# EasyEDA Pro project ProPrj_MEMSdesign_2025-04-10.epro, schematic F103_1

## Sheets
1 core: Board Name: main_1; Create Date: 2025-03-18; Page Name: core; Project Name: MEMSdesign; Schematic Name: F103_1; Update Date: 2025-04-07; Company: 嘉立创EDA; Page Size: A4; Reviewed: 嘉立创EDA
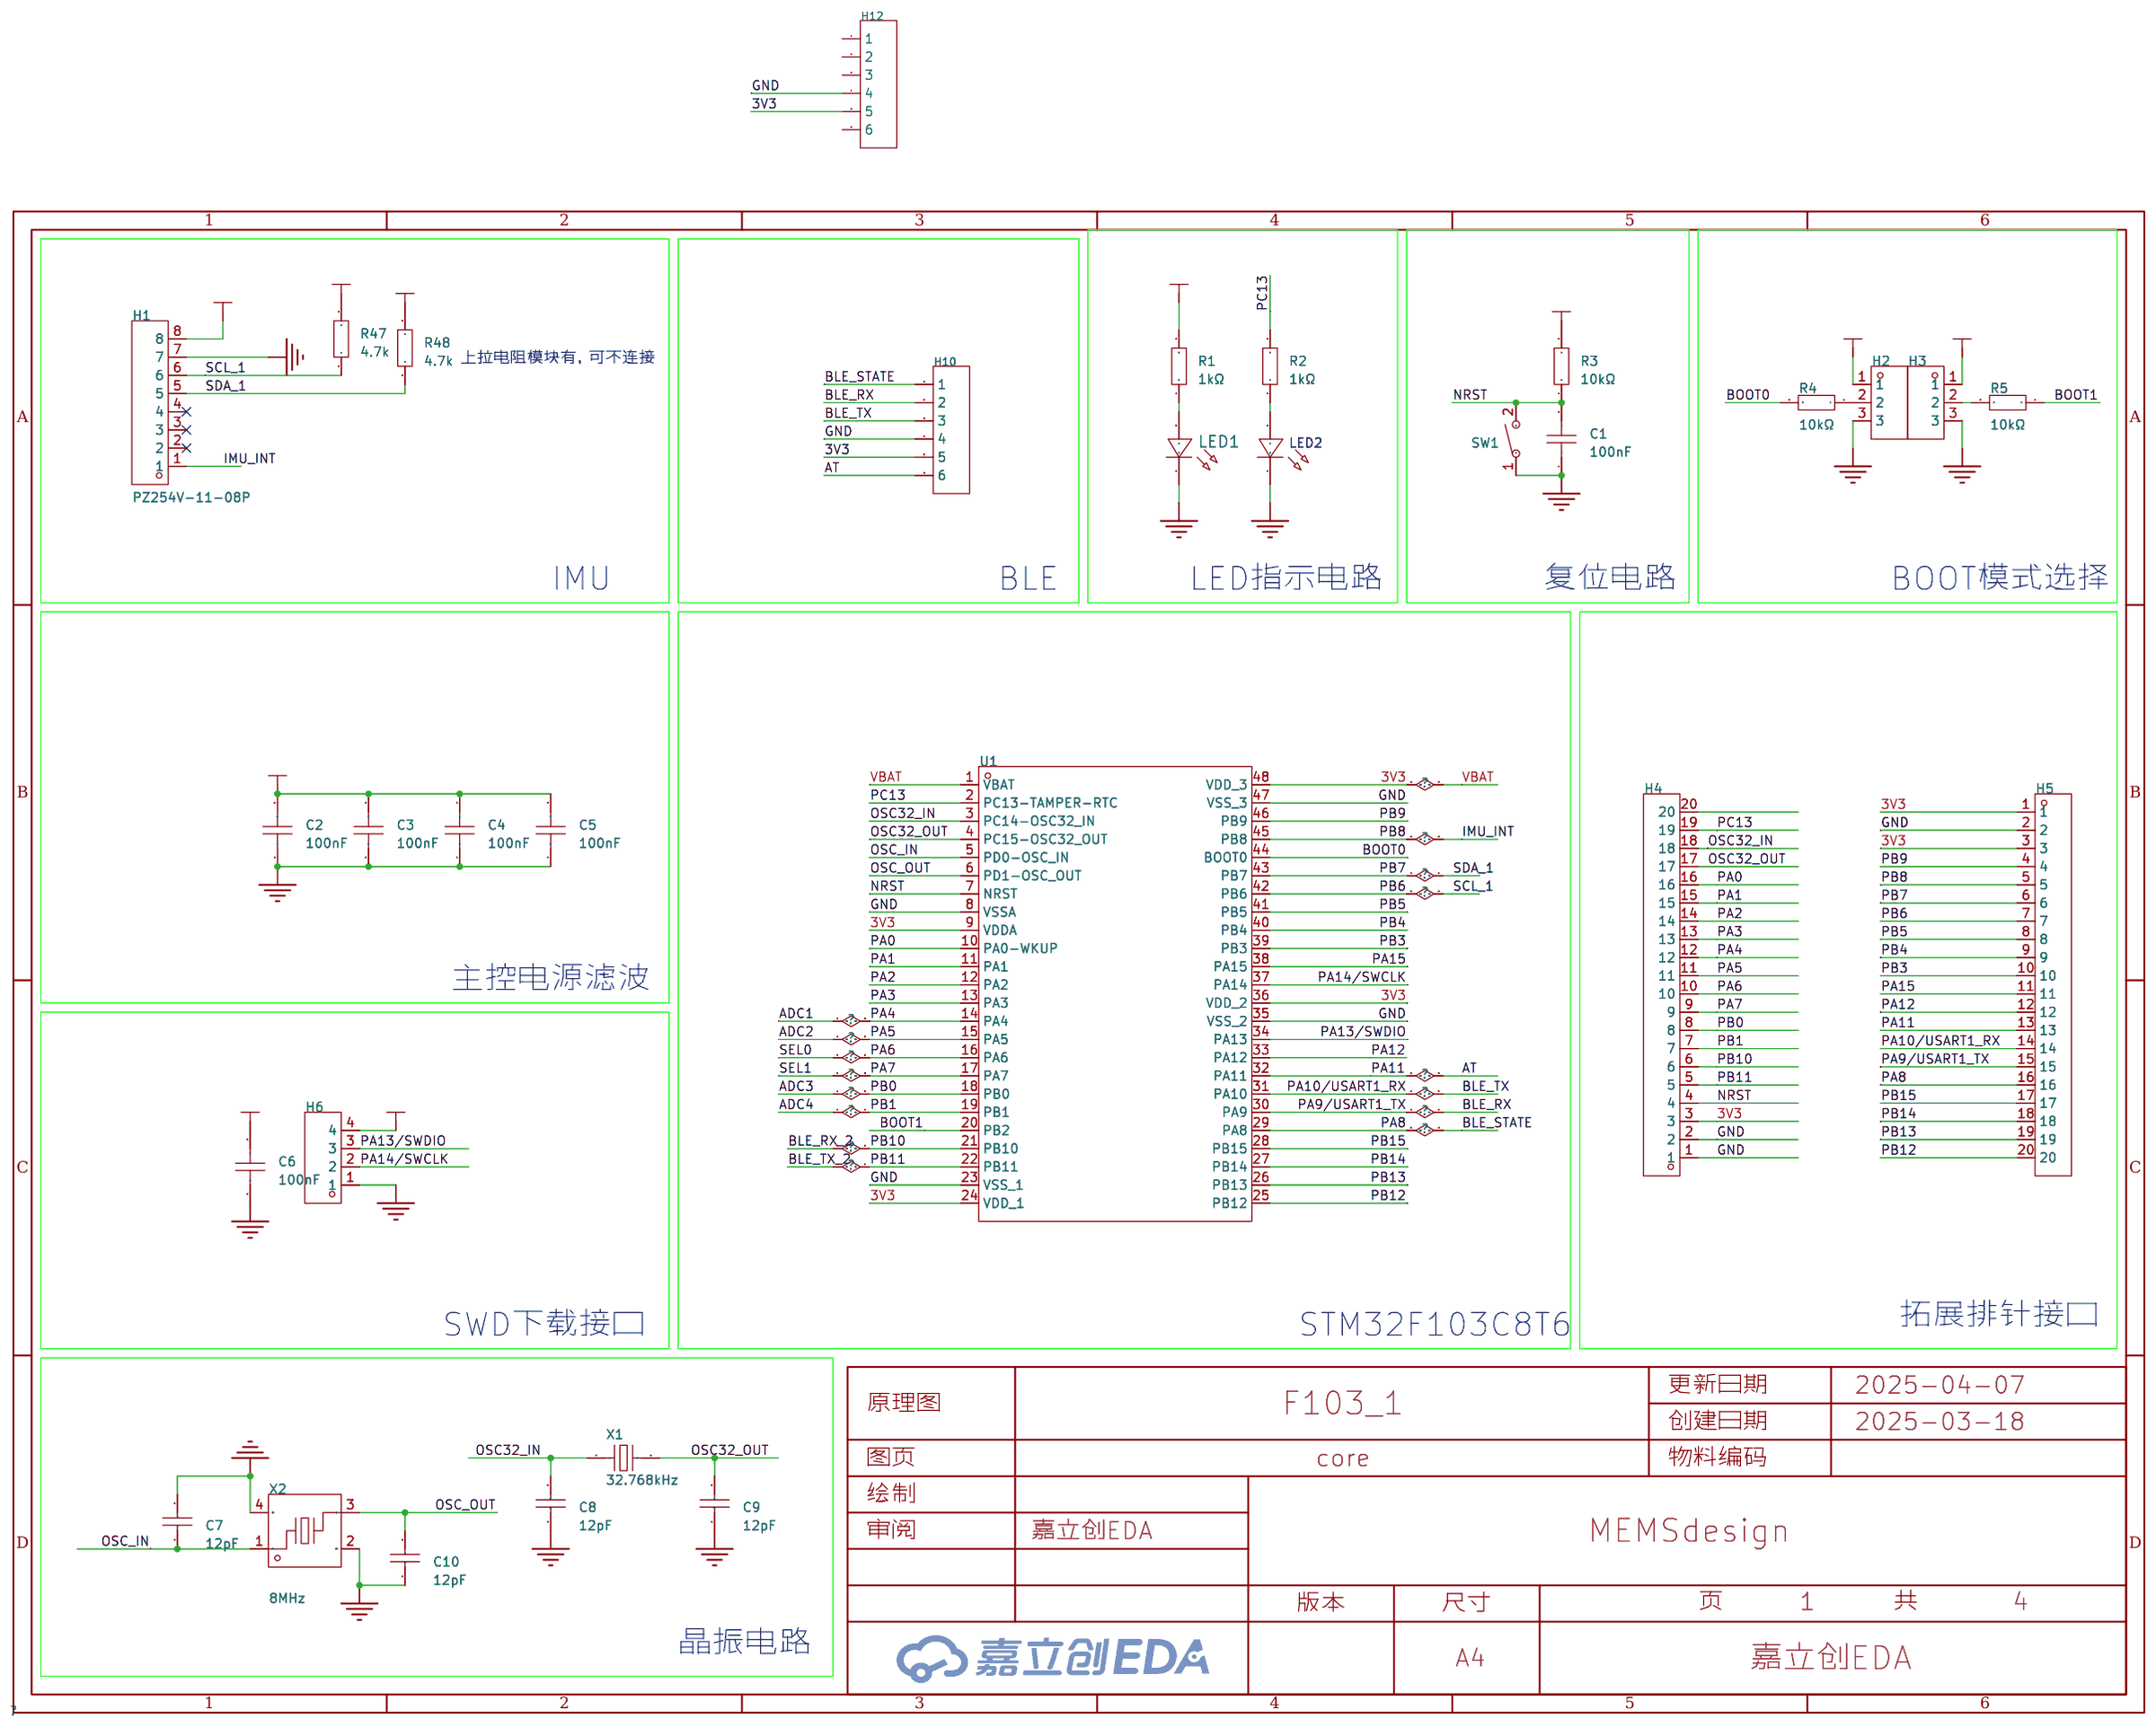
[diagram p0: core]
2 power: Page Name: power; Update Date: 2025-03-18; Version: V1.0
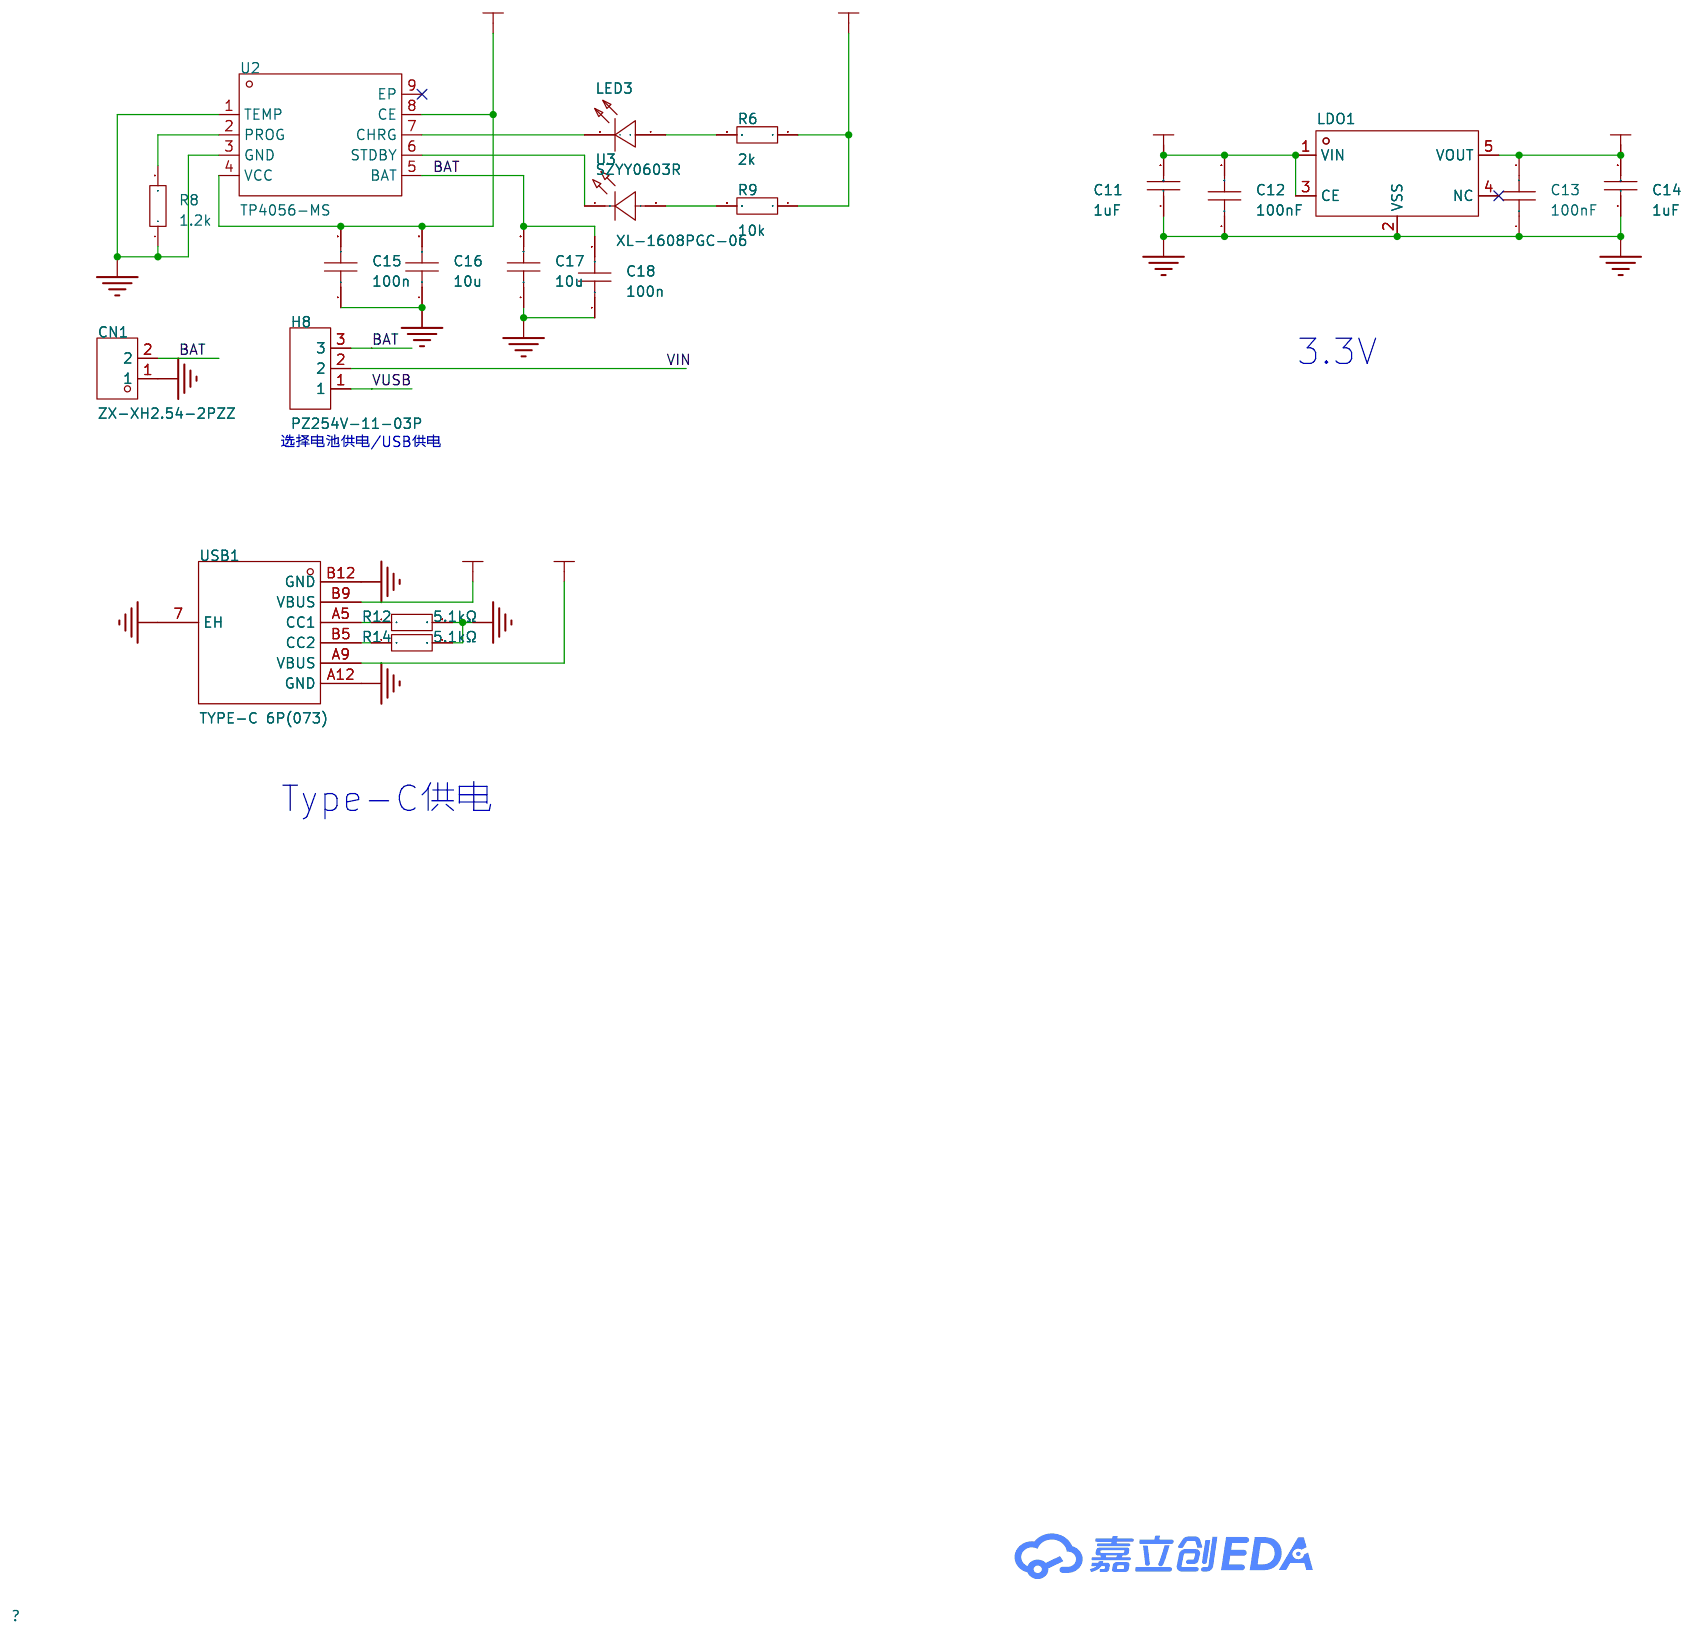
[diagram p1: power]
3 sample: Page Name: sample; Version: V1.0
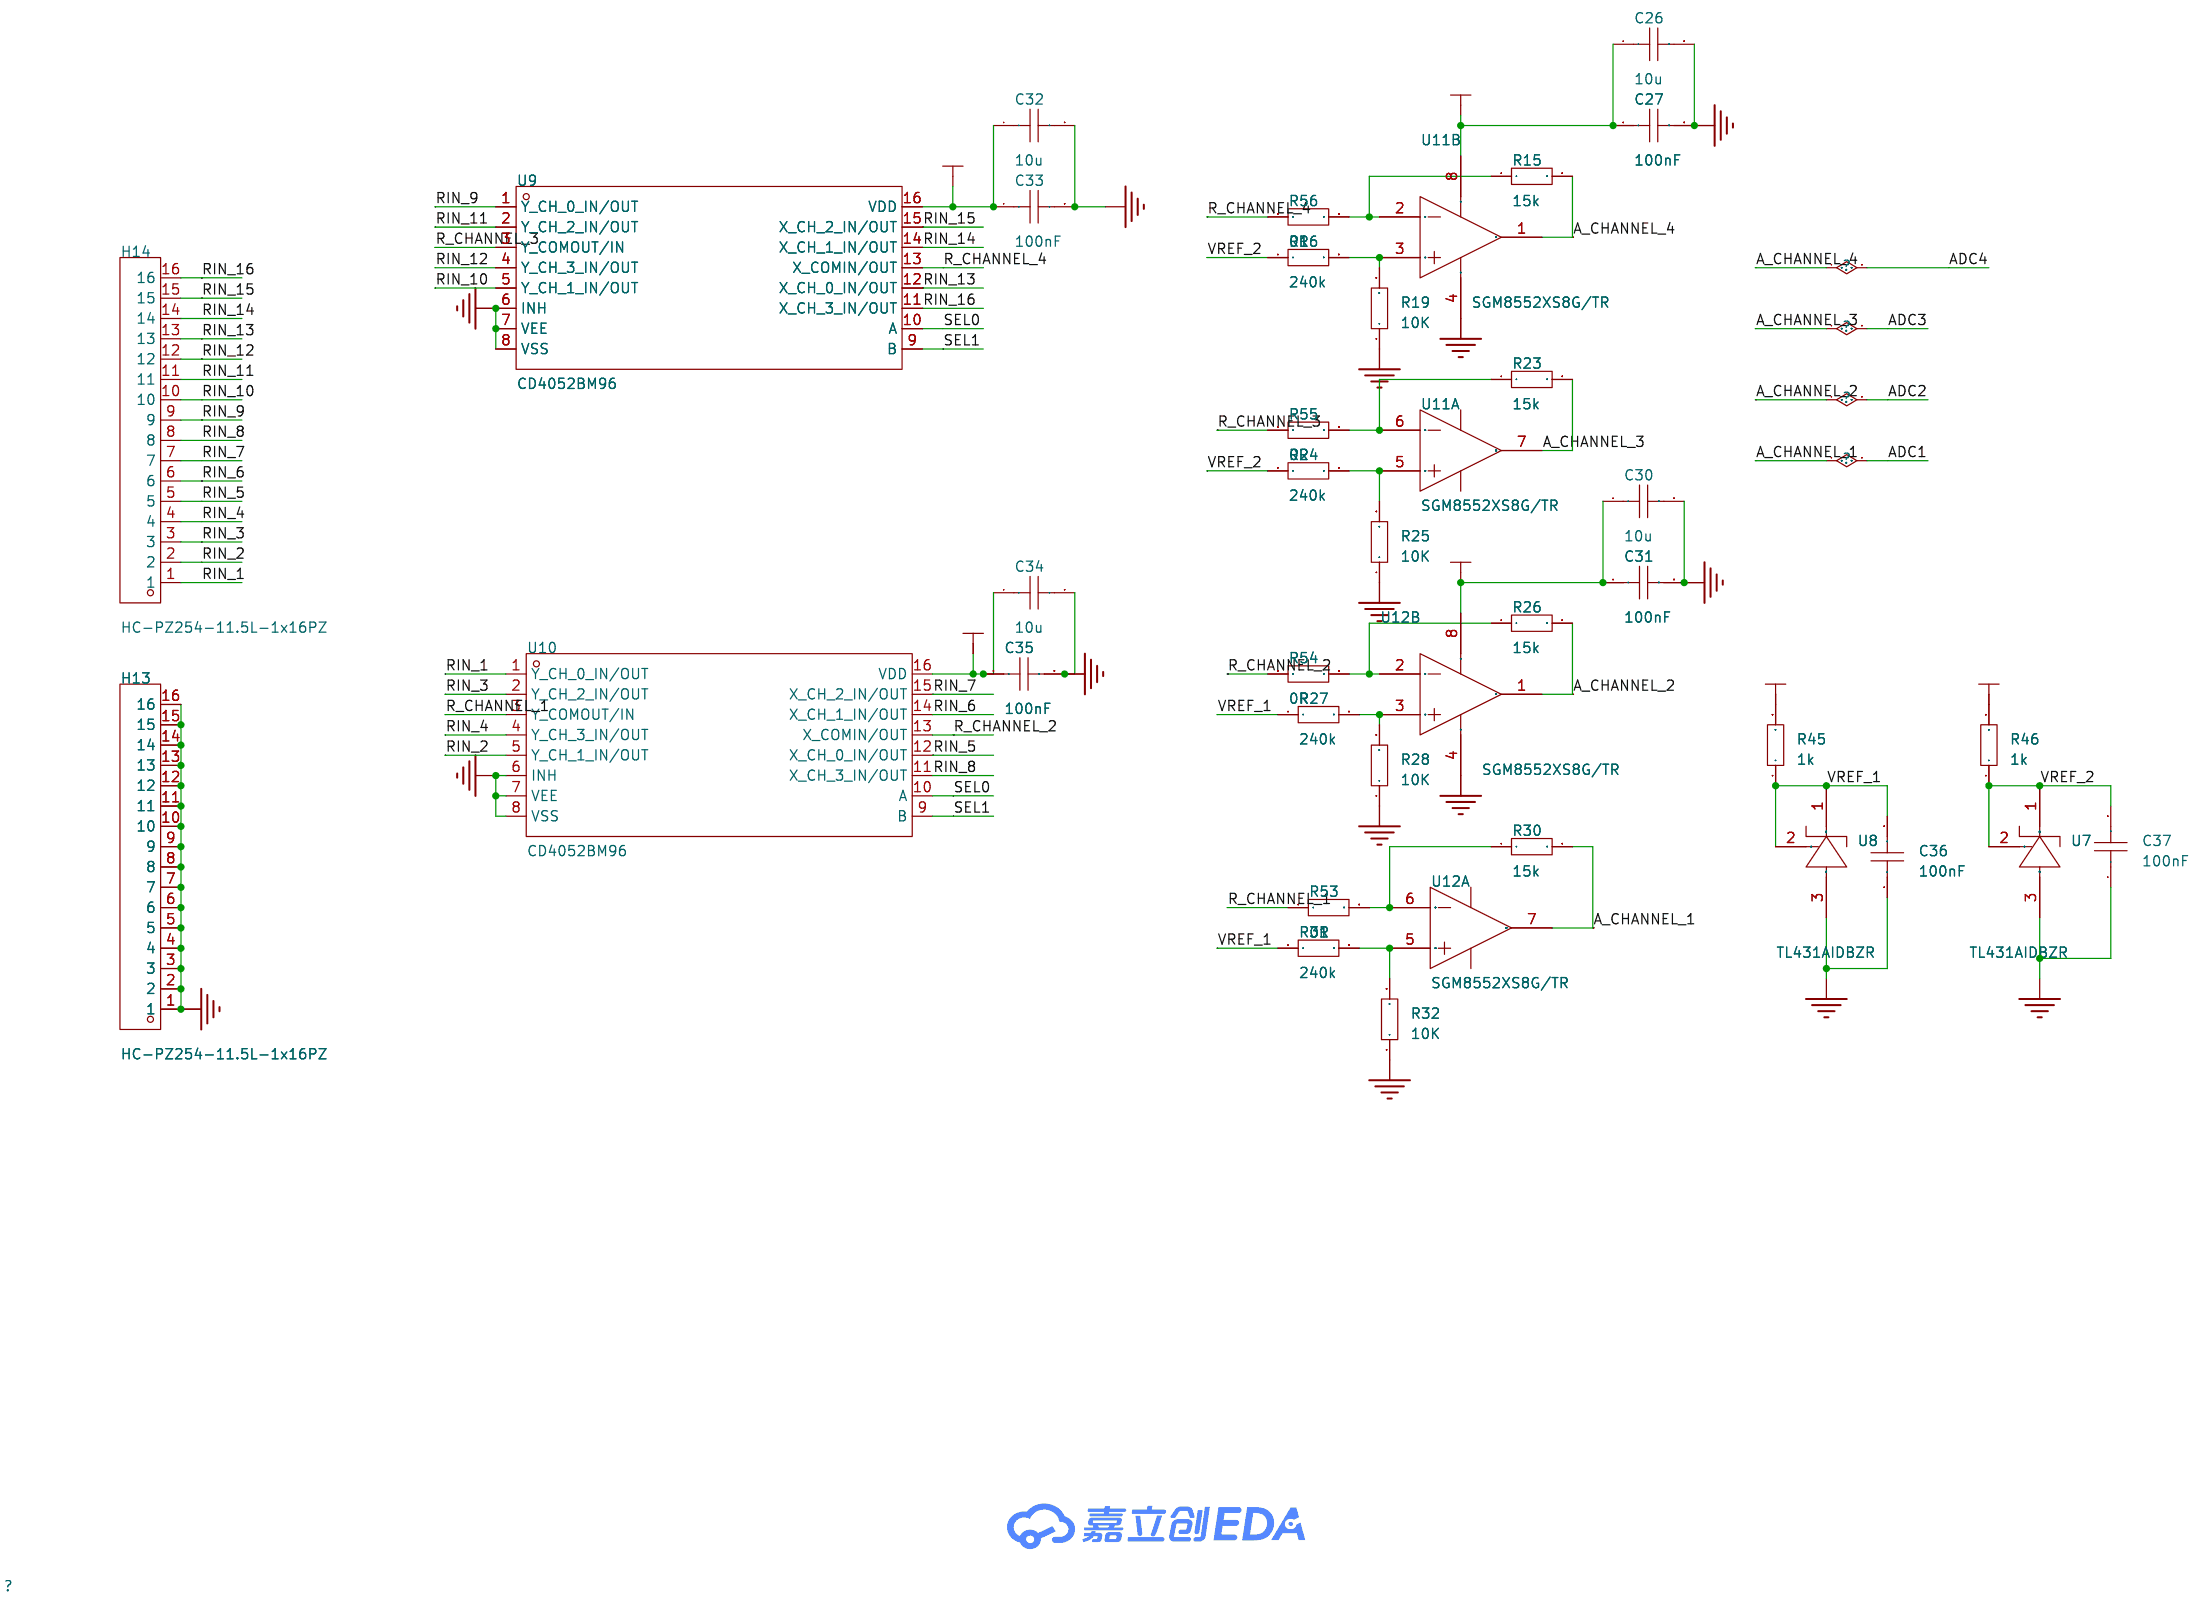
[diagram p2: sample]
4 ble: Page Name: ble; Update Date: 2025-03-18; Version: V1.0
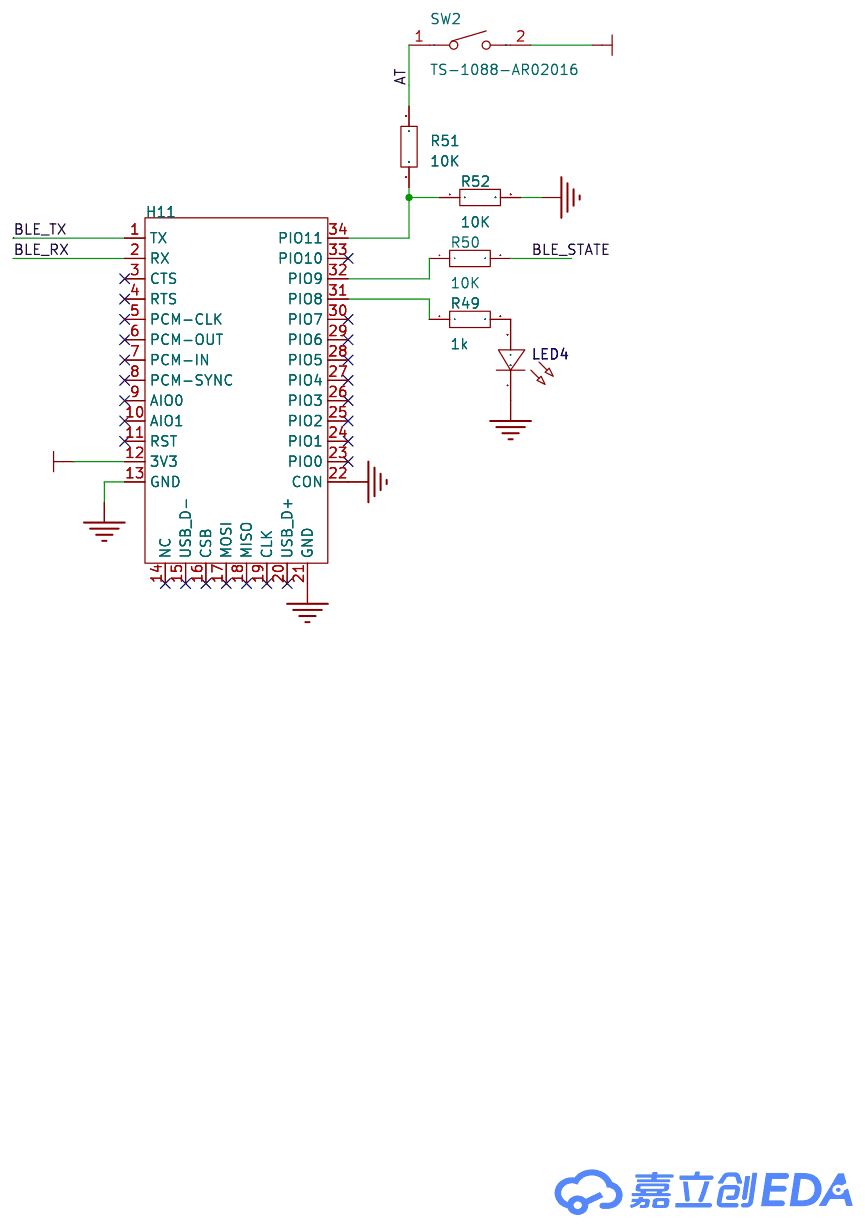
[diagram p3: ble]

## Parts
sheet ble
H11  HC05  [BULETM-SMD_HC-05]
LED4  -  [LED_0603]
R49  1k  [R0603]
R50  10K  [R0603]
R51  10K  [R0603]
R52  10K  [R0603]
SW2  TS-1088-AR02016  [SW-SMD_L3.9-W3.0-P4.45]
sheet core
C1  100nF  [C0603]
C2  100nF  [C0603]
C3  100nF  [C0603]
C4  100nF  [C0603]
C5  100nF  [C0603]
C6  100nF  [C0603]
C7  12pF  [C0402]
C8  12pF  [C0402]
C9  12pF  [C0402]
C10  12pF  [C0402]
H1  PZ254V-11-08P  [HDR-TH_8P-P2.54-V-M]
H2  -  [HDR-TH_3P-P2.54-V-M]
H3  -  [HDR-TH_3P-P2.54-V-M]
H4  -  [HDR-TH_20P-P2.54-V-M-1]
H5  -  [HDR-TH_20P-P2.54-V-M-1]
H6  -  [HDR-TH_4P-P2.54-V-M]
H10  -  [HDR-TH_6P-P2.54-V-M-1]
H12  -  [HDR-TH_6P-P2.54-V-M-1]
LED1  -  [LED_0603]
LED2  -  [LED_0603]
R1  1kΩ  [R0603]
R2  1kΩ  [R0603]
R3  10kΩ  [R0603]
R4  10kΩ  [R0603]
R5  10kΩ  [R0603]
R47  4.7k  [R0603]
R48  4.7k  [R0603]
SW1  TS-1101-B-W  [KEY-SMD_2P-L6.0-W3.6-P7.4-LS8.0-L]
U1  STM32F103C8T6  [LQFP-48_L7.0-W7.0-P0.50-LS9.0-BL]
X1  32.768kHz  [OSC-SMD_L3.2-W1.5]
X2  8MHz  [CRYSTAL-SMD_4P-L3.2-W2.5-BL-1]
sheet power
C11  1uF  [C0603]
C12  100nF  [C0603]
C13  100nF  [C0603]
C14  1uF  [C0603]
C15  100n  [C0603]
C16  10u  [C0603]
C17  10u  [C0603]
C18  100n  [C0603]
CN1  ZX-XH2.54-2PZZ  [CONN-TH_2P-P2.50_HX25003-2A]
H8  PZ254V-11-03P  [HDR-TH_3P-P2.54-V-M]
LDO1  ME6211C33M5G-N  [SOT-23-5_L3.0-W1.7-P0.95-LS2.8-BL]
LED3  SZYY0603R  [LED0603-R-RD]
R6  2k  [R0603]
R8  1.2k  [R0603]
R9  10k  [R0603]
R12  5.1kΩ  [R0603]
R14  5.1kΩ  [R0603]
U2  TP4056-MS  [SOP-8_L4.9-W3.9-P1.27-LS6.0-TL-EP]
U3  XL-1608PGC-06  [LED0603-RD_GREEN]
USB1  TYPE-C 6P(073)  [TYPE-C-SMD_TYPE-C-6P_5]
sheet sample
C26  10u  [C0603]
C27  100nF  [C0603]
C30  10u  [C0603]
C31  100nF  [C0603]
C32  10u  [C0603]
C33  100nF  [C0603]
C34  10u  [C0603]
C35  100nF  [C0603]
C36  100nF  [C0603]
C37  100nF  [C0603]
H13  HC-PZ254-11.5L-1x16PZ  [HDR-TH_16P-P2.54-V-M]
H14  HC-PZ254-11.5L-1x16PZ  [HDR-TH_16P-P2.54-V-M]
R15  15k  [R0603]
R16  240k  [R0603]
R19  10K  [R0603]
R23  15k  [R0603]
R24  240k  [R0603]
R25  10K  [R0603]
R26  15k  [R0603]
R27  240k  [R0603]
R28  10K  [R0603]
R30  15k  [R0603]
R31  240k  [R0603]
R32  10K  [R0603]
R45  1k  [R0603]
R46  1k  [R0603]
R53  0R  [R0603]
R54  0R  [R0603]
R55  0R  [R0603]
R56  0R  [R0603]
U7  TL431AIDBZR  [SOT-23-3_L2.9-W1.6-P1.90-LS2.8-BR]
U8  TL431AIDBZR  [SOT-23-3_L2.9-W1.6-P1.90-LS2.8-BR]
U9  CD4052BM96  [SOIC-16_L9.9-W3.9-P1.27-LS6.0-BL]
U10  CD4052BM96  [SOIC-16_L9.9-W3.9-P1.27-LS6.0-BL]
U11  SGM8552XS8G/TR  [SOIC-8_L4.9-W3.9-P1.27-LS6.0-BL]  (sections 1,2)
U12  SGM8552XS8G/TR  [SOIC-8_L4.9-W3.9-P1.27-LS6.0-BL]  (sections 1,2)

## Library data of the parts
H11 = HC05: _: 3
LED2 LED4 = LED_0603-B: Supplier Footprint: 0603; Supplier Part: C84266
R6 R8 R9 R15 R16 R19 R23-R28 R30-R32 R45-R56 = Res_0603: Supplier Footprint: 0603
SW2 = TS-1088-AR02016: 电路结构:单刀单掷;按钮形状:圆形按钮;作用力:160gf;安装方式:立贴;开关长度:4mm;开关宽度:3mm;开关高度:2mm;带支架:不带;触点电流:50mA;额定电压(DC):12V;绝缘电阻:100MΩ;机械寿命:10万次;; LCSC Part Name: 4*3*2mm 立贴 轻触开关; Supplier Part: C720477; Manufacturer: XUNPU(讯普); Supplier Footprint: SMD; JLCPCB Part Class: 扩展库; Datasheet: https://atta.szlcsc.com/upload/public/pdf/source/20200810/C720475_60D09DD6C54279ADDB2DC25100F1CC11.pdf; Supplier: LCSC; Circuit: 单刀单掷; Actuator Style: 圆形按钮; Operating Force: 160gf; Mounting Style: 立贴; Switch Length: 4mm; Switch Width: 3mm; Switch Height: 2mm; Strike Gundam: 不带; Contact Current: 50mA; Voltage Rating (DC): 12V; Insulation Resistance: 100MΩ; Actuator/Cap Color: 黑色; Pin Style: SMD接片; Mechanical Life: 10万次; Operating Temperature: -30℃~+80℃
C1-C6 C12 C13 = GRM155R71H104KE14D: 容值:100nF;精度:±10%;额定电压:50V;材质(温度系数):X7R;; LCSC Part Name: 100nF ±10% 50V; Supplier Part: C77020; Manufacturer: muRata(村田); Supplier Footprint: 0402; JLCPCB Part Class: 扩展库; Datasheet: https://atta.szlcsc.com/upload/public/pdf/source/20180326/C77020_39BD49C951FF1AF0DB1F1FAC5AC1E401.pdf; Supplier: LCSC; Tolerance: ±10%; Voltage Rated: 50V; Temperature Coefficient: X7R
C7-C10 = 0402CG120J500NT: 容值:12pF;精度:±5%;额定电压:50V;材质(温度系数):C0G;; LCSC Part Name: 12pF ±5% 50V; Supplier Part: C1547; Manufacturer: FH(风华); Supplier Footprint: 0402; JLCPCB Part Class: 基础库; Datasheet: https://atta.szlcsc.com/upload/public/pdf/source/20200305/C486355_26A10D38EF8C2A5C37091D0039909270.pdf; Supplier: LCSC; Tolerance: ±5%; Voltage Rated: 50V; Temperature Coefficient: C0G
H1 = PZ254V-11-08P: 插针结构:1x8P;间距:2.54mm;行距:-;圆针/方针:方针;安装类型:直插;排数:单排;总PIN位数:8P;额定电流:-;额定电压:-;配合针长度:6mm;塑高:2.5mm;端接针长度:3mm;触头材质:黄铜;触头镀层:-;工作温度范围:-40℃~+105℃;颜色:黑色;; LCSC Part Name: 间距:2.54mm 1x8P 直插 方针; Supplier Part: C492407; Manufacturer: XFCN(兴飞); Supplier Footprint: 插件,P=2.54mm; JLCPCB Part Class: 扩展库; Datasheet: https://atta.szlcsc.com/upload/public/pdf/source/20200309/C492407_83A6FB26A2233368EDB9516968EC6149.pdf; Supplier: LCSC; Pin Structure: 1x8P; Pitch: 2.54mm; Circluar Pins/Square Pins: 方针; Mounting Type: 直插; Number of Rows: 单排; Number of Pins: 8P; Length of Mating Pin: 6mm; Insulation Height: 2.5mm; Length of End Connection Pin: 3mm; Contact Material: 黄铜; Operating Temperature Range: -40℃~+105℃; Color: 黑色
H2 H3 = HDR-M_2.54_1x3P: Supplier Part: C2937625; Supplier Footprint: 插件
H4 H5 = HDR-M_2.54_1x20P: 间距:2.54mm;总PIN位数:20;排数:1;插针结构:-;行距:-;安装类型:直插;圆针/方针:-;额定电流:-;额定电压:-;配合针长度:-;塑高:-;触头材质:黄铜;触头镀层:-;颜色:黑色;; Supplier Part: C50981; Supplier Footprint: 插件
H6 = HDR-M_2.54_1x4P: Supplier Part: C2935929; Supplier Footprint: 插件
H10 H12 = HDR-M_2.54_1x6P: Supplier Part: C37208; Supplier Footprint: 插件
LED1 = LED_0603-R: Supplier Footprint: 0603; Supplier Part: C84263
R1 R2 = 0402WGF1001TCE: 电阻类型:厚膜电阻;阻值:1kΩ;精度:±1%;功率:62.5mW;最大工作电压:50V;温度系数:±100ppm/℃;; LCSC Part Name: 1kΩ ±1% 62.5mW 厚膜电阻; Supplier Part: C11702; Manufacturer: UNI-ROYAL(厚声); Supplier Footprint: 0402; JLCPCB Part Class: 基础库; Datasheet: https://atta.szlcsc.com/upload/public/pdf/source/20200306/C422600_1E6D84923E4A46A82E41ADD87F860B5C.pdf; Supplier: LCSC; Type: 厚膜电阻; Tolerance: ±1%; Power(Watts): 62.5mW; Overload Voltage (Max): 50V; Temperature Coefficient: ±100ppm/℃; Operating Temperature Range: -55℃~+155℃
R3-R5 = RC0402FR-0710KL: 电阻类型:厚膜电阻;阻值:10kΩ;精度:±1%;功率:62.5mW;最大工作电压:50V;温度系数:±100ppm/℃;; LCSC Part Name: 厚膜电阻 10kΩ ±1% 62.5mW; Supplier Part: C60490; Manufacturer: YAGEO(国巨); Supplier Footprint: 0402; JLCPCB Part Class: 扩展库; Datasheet: https://atta.szlcsc.com/upload/public/pdf/source/20170925/C131467_1506321478108990263.pdf; Supplier: LCSC; Type: 厚膜电阻; Tolerance: ±1%; Power(Watts): 62.5mW; Overload Voltage (Max): 50V; Temperature Coefficient: ±100ppm/℃; Operating Temperature Range: -55℃~+155℃
SW1 = TS-1101-B-W_C500065: 触点电流:50mA;额定电压(DC):12V;绝缘电阻:-;电路结构:单刀单掷;安装方式:立贴;带灯:无;作用力:160gf;机械寿命:5万次;带支架:否;; LCSC Part Name: 6*3.6*2.5mm 立贴 轻触开关; Supplier Part: C500065; Manufacturer: XKB Connectivity(中国星坤); Supplier Footprint: SMD; JLCPCB Part Class: 扩展库; Datasheet: https://atta.szlcsc.com/upload/public/pdf/source/20211011/D0E0CAF534F7B19DDE4CE68748A25BD3.pdf; Supplier: LCSC; Contact Current: 50mA; Voltage Rating (DC): 12V; Circuit: 单刀单掷; Mounting Style: 立贴; Actuator Style: 矩形按钮; Actuator/Cap Color: 白色; With Lamp: 无; Operating Force: 160gf; Mechanical Life: 5万次; Operating Temperature: -30℃~+85℃; Switch Length: 6mm; Switch Width: 3.6mm; Switch Height: 2.5mm; Strike Gundam: 否
U1 = STM32F103C8T6: CPU内核:CM3;程序存储容量:64KB;RAM总容量:20KB;GPIO端口数量:37;工作电压范围:2V~3.6V;CPU最大主频:72MHz;程序存储器类型:FLASH;; LCSC Part Name: STM32F103C8T6 MSL=3; Supplier Part: C8734; Manufacturer: ST(意法半导体); Supplier Footprint: LQFP-48(7x7); JLCPCB Part Class: 扩展库; Datasheet: https://atta.szlcsc.com/upload/public/pdf/source/20220812/8363ACEC51AD55ECEB84799464F7CB85.pdf; Supplier: LCSC; CPU Core: CM3; Program Storage Size: 64KB; RAM Size: 20KB; GPIO Ports Number: 37; Operating Voltage Range: 2V~3.6V; CPU Maximum Speed: 72MHz; Program Memory Type: FLASH; Operating Temperature Range: -40℃~+85℃; ADC (Bit): 12bit; Universal Serial Bus: 有; Peripheral/Function: 看门狗；DMA；看门狗；片载温度传感器; Watchdog: 有; Infrared Data Association: 有; Low-Voltage Detect: 有; Direct Memory Access: 有; Internal Oscillator: 有
X1 = X321532768KGD2SI: 晶振类型:贴片晶振;频率:32.768kHz;常温频差:±20ppm;外接负载电容:12.5pF;频率稳定度(全温):-;; LCSC Part Name: 32.768kHz ±20ppm 12.5pF; Supplier Part: C620155; Manufacturer: YXC(扬兴晶振); Supplier Footprint: SMD3215-2P; JLCPCB Part Class: 扩展库; Datasheet: https://atta.szlcsc.com/upload/public/pdf/source/20240329/3A7650FD985DD0DE85694D3785AB4916.pdf; Supplier: LCSC; Crystal Type: 贴片晶振; Normal temperature Frequency Tolerance: ±20ppm; External load capacitor: 12.5pF; Operating Temperature: -40℃~+85℃
X2 = XL2EL89COI-111YLC-8M: 晶振类型:贴片晶振;频率:8MHz;常温频差:±10ppm;外接负载电容:12pF;频率稳定度(全温):±20ppm;; LCSC Part Name: 8MHz ±10ppm 12pF; Supplier Part: C2973805; Manufacturer: YXC(扬兴晶振); Supplier Footprint: SMD3225-4P; JLCPCB Part Class: 扩展库; Datasheet: https://atta.szlcsc.com/upload/public/pdf/source/20240329/19D5F850207469550BEB00D7DFEDBC7A.pdf; Supplier: LCSC; Crystal Type: 贴片晶振; Normal temperature Frequency Tolerance: ±10ppm; External load capacitor: 12pF; Frequency Stability(Full temperature range): ±20ppm; Equivalent Series Resistance (ESR): 150Ω; Operating Temperature: -40℃~+85℃
C11 C14 = CL05A105KP5NNNC: 容值:1uF;精度:±10%;额定电压:10V;材质(温度系数):X5R;; LCSC Part Name: 1uF ±10% 10V; Supplier Part: C14445; Manufacturer: SAMSUNG(三星); Supplier Footprint: 0402; JLCPCB Part Class: 扩展库; Datasheet: https://atta.szlcsc.com/upload/public/pdf/source/20160218/1457707763339.pdf; Supplier: LCSC; Tolerance: ±10%; Voltage Rated: 10V; Temperature Coefficient: X5R
C15-C18 C26 C27 C30-C37 = CAP_0603: Supplier Footprint: 0603
CN1 = ZX-XH2.54-2PZZ: 插针结构:1x2P;间距:2.5mm;安装方式:直插;参考系列:XH;总PIN数:2P;排数:1;每排PIN数:2;行距:-;额定电流:3A;触头材质:黄铜;触头镀层:锡;工作温度范围:-25℃~+85℃;; LCSC Part Name: 1x2P 间距:2.5mm 直插 系列:XH; Supplier Part: C7429632; Manufacturer: Megastar(兆星); Supplier Footprint: 插件,P=2.5mm; JLCPCB Part Class: 扩展库; Datasheet: https://atta.szlcsc.com/upload/public/pdf/source/20230619/19BA6947230AA44A04D3EDD65E618FD0.pdf; Supplier: LCSC; Pins Structure: 1x2P; Pitch: 2.5mm; Mounting Type: 直插; Reference Series: XH; Number of Pins: 2P; Number of Rows: 1; Number of PINs Per Row: 2; Rated Current: 3A; Contact Material: 黄铜; Contact Plating: 锡; Operating Temperature: -25℃~+85℃; Rated Voltage (Max): 250V; Plastic Material: PA66; Flame Retardant Rating: UL94V-0; Color: 白色; Z-Height of the Board: 7mm; X-Length of Bottom Edge on Board (Spacing Line): 7.5mm; Y-Width of Bottom Edge on Board: 5.9mm
H8 = PZ254V-11-03P: 插针结构:1x3P;间距:2.54mm;行距:-;圆针/方针:方针;安装方式:直插;排数:单排;总PIN位数:3P;额定电流:3A;额定电压:250V;配合针长度:6mm;塑高:2.5mm;端接针长度:3mm;工作温度:-40℃~+105℃;颜色:黑色;; LCSC Part Name: 1x3P 间距:2.54mm 方针 直插; Supplier Part: C2937625; Manufacturer: XFCN(兴飞); Supplier Footprint: 插件,P=2.54mm; JLCPCB Part Class: 扩展库; Datasheet: https://atta.szlcsc.com/upload/public/pdf/source/20200309/C492402_8335C3D49C4E4C618838D59BB1D024C1.pdf; Supplier: LCSC; Pin Structure: 1x3P; Pitch: 2.54mm; Circluar Pins/Square Pins: 方针; Mounting Type: 直插; Number of Rows: 单排; Number of Pins: 3P; Current Rating: 3A; Voltage Rating (Max): 250V; Length of Mating Pin: 6mm; Insulation Height: 2.5mm; Length of End Connection Pin: 3mm; Operating Temperature: -40℃~+105℃; Color: 黑色
LDO1 = ME6211C33M5G-N: 输出类型:固定;输出极性:正;最大输入电压:6V;输出电压:3.3V;输出电流:500mA;电源纹波抑制比(PSRR):70dB;; Supplier Part: C82942; Manufacturer: MICRONE(南京微盟); Supplier Footprint: SOT-23-5; JLCPCB Part Class: 扩展库; Datasheet: https://atta.szlcsc.com/upload/public/pdf/source/20170918/C82942_1505727073070976520.pdf; Supplier: LCSC; Output Type: 固定; Output Polarity: 正; Number of Outputs: 1; Maximum Input Voltage: 6V; Output Voltage: 3.3V; Dropout Voltage: 260mV@(200mA); Output Current: 500mA; Power Supply Rejection Ratio (PSRR): 70dB
LED3 = SZYY0603R: 发光颜色:红色;功率:40mW;正向电流:20mA;主波长:615nm~630nm;二极管配置:-;透镜颜色:无色透明透镜;色温:-;发光角度:120°;载带方式:-;工作温度:-40℃~+85℃;; LCSC Part Name: 红灯; Supplier Part: C434419; Manufacturer: yongyu(永裕光电); Supplier Footprint: 0603; JLCPCB Part Class: 扩展库; Datasheet: https://atta.szlcsc.com/upload/public/pdf/source/20191204/C434419_0B955C1F73FF88449D9A795B6FF49070.pdf; Supplier: LCSC; Emitted Color: 红色; Power Dissipation: 40mW; Forward Current: 20mA; Dominant Wavelength: 615nm~630nm; Peak Wavelength: 645nm; Lens Color: 无色透明透镜; Viewing Angle: 120°; Operating Temperature: -40℃~+85℃
R12 R14 = 0402WGF5101TCE: 电阻类型:厚膜电阻;阻值:5.1kΩ;精度:±1%;功率:62.5mW;最大工作电压:50V;温度系数:±100ppm/℃;; LCSC Part Name: 5.1kΩ ±1% 62.5mW 厚膜电阻; Supplier Part: C25905; Manufacturer: UNI-ROYAL(厚声); Supplier Footprint: 0402; JLCPCB Part Class: 基础库; Datasheet: https://atta.szlcsc.com/upload/public/pdf/source/20200306/C422600_1E6D84923E4A46A82E41ADD87F860B5C.pdf; Supplier: LCSC; Type: 厚膜电阻; Tolerance: ±1%; Power(Watts): 62.5mW; Overload Voltage (Max): 50V; Temperature Coefficient: ±100ppm/℃; Operating Temperature Range: -55℃~+155℃
U2 = TP4056-MS: 电源电压:4.2V~9V;最大充电电流:1A;电池类型:锂离子/聚合物;电池节数:1;; Supplier Part: C7473158; Manufacturer: MSKSEMI(美森科); Supplier Footprint: SOP-8-EP; JLCPCB Part Class: 扩展库; Datasheet: https://atta.szlcsc.com/upload/public/pdf/source/20230808/7F9175670C53D6763A7A5691214AEA38.pdf; Supplier: LCSC; Supply Voltage: 4.2V~9V; Maximum Charge Current: 1A; Type of Battery: 锂离子/聚合物; Number of Cells: 1; Operating Temperature: -40℃~+85℃
U3 = XL-1608PGC-06: 灯头类型:-;发光颜色:翠绿色;正向电压(VF):2.6V~3V;功率:75mW;正向电流:5mA;主波长:505nm~540nm;二极管配置:-;透镜颜色:绿色透镜;色温:-;发光强度:299mcd;发光角度:130°;载带方式:正贴;工作温度:-;; Supplier Part: C7371905; Manufacturer: XINGLIGHT(成兴光); Supplier Footprint: 0603; JLCPCB Part Class: 扩展库; Datasheet: https://atta.szlcsc.com/upload/public/pdf/source/20240218/2F8A7AF596DEEB38157DAB7856E382C0.pdf; Supplier: LCSC; Emitted Color: 翠绿色; Forward Voltage (VF): 2.6V~3V; Power Dissipation: 75mW; Forward Current: 5mA; Dominant Wavelength: 505nm~540nm; Peak Wavelength: 530nm; Lens Color: 绿色透镜; Luminous Intensity: 299mcd; Viewing Angle: 130°; Mounting Sytle: 正贴
USB1 = TYPE-C 6P(073): 连接器类型:Type-C;标准:USB 3.1;公母:母;安装方式:卧贴;触点数量:6P;端口数量:1;额定电流 - 电源:3A;工作温度范围:-25℃~+85℃;; LCSC Part Name: Type-C 母 卧贴; Supplier Part: C668623; Manufacturer: SHOU HAN(首韩); Supplier Footprint: SMD; JLCPCB Part Class: 扩展库; Datasheet: https://atta.szlcsc.com/upload/public/pdf/source/20200618/C668623_A4B260DED7AC1949BAC6AE39E9F4CD80.pdf; Supplier: LCSC; Connector Type: Type-C; Standard: USB 3.1; Gender: 母; Mounting Style: 卧贴; Number of Contacts: 6P; Number of Ports: 1; Current Rating - Power (Max): 3A; Operating Temperature Range: -25℃~+85℃; Rated Voltage (Max): 3V3; Connect-Disconnect Life: 1万次; Core Colour: 黑色
H13 H14 = HC-PZ254-11.5L-1x16PZ: 插针结构:1x16P;间距:2.54mm;行距:-;圆针/方针:方针;安装方式:直插;排数:单排;总PIN位数:16P;额定电流:3A;额定电压:-;配合针长度:6mm;塑高:2.5mm;端接针长度:3mm;触头材质:黄铜;触头镀层:金;工作温度:-40℃~+105℃;颜色:黑色;; LCSC Part Name: 1x16P 间距:2.54mm 方针 直插; Supplier Part: C41375939; Manufacturer: HC(虹成电子); Supplier Footprint: 插件,P=2.54mm; Datasheet: https://atta.szlcsc.com/upload/public/pdf/source/20250106/4A35C24849FE515755A23C8AA861D16D.pdf; Supplier: LCSC; Pin Structure: 1x16P; Pitch: 2.54mm; Circluar Pins/Square Pins: 方针; Mounting Type: 直插; Number of Rows: 单排; Number of Pins: 16P; Current Rating: 3A; Length of Mating Pin: 6mm; Insulation Height: 2.5mm; Length of End Connection Pin: 3mm; Contact Material: 黄铜; Contact Plating: 金; Operating Temperature: -40℃~+105℃; Color: 黑色
U7 U8 = TL431AIDBZR: 3V3; Supplier Part: C23892; Manufacturer: TI(德州仪器); Supplier Footprint: SOT-23; JLCPCB Part Class: 扩展库; Datasheet: https://www.ti.com/cn/lit/gpn/tl431; Supplier: LCSC; Output Type: 可调; Output Voltage: 3V3; Output Current: 100mA; Tolerance: ±1%; Reference Type: 并联; Minimum Cathode Current for Regulation: 700uA; Operating Temperature: -40℃~+85℃@(Ta)
U9 U10 = CD4052BM96: 开关电路:单刀四掷(SP4T);通道数:2;导通电阻(Ron@VCC):240Ω;; LCSC Part Name: CD4052B CMOS模拟多路复用器/解复用器; Supplier Part: C6521; Manufacturer: TI(德州仪器); Supplier Footprint: SOIC-16; JLCPCB Part Class: 扩展库; Datasheet: https://www.ti.com/cn/lit/gpn/cd4053b; Supplier: LCSC; Switch Circuit: 单刀四掷(SP4T); Number of Channels: 2; Supply Voltage: 3V~20V; On-State Resistance (Max): 240Ω
U11 U12 = SGM8552XS8G/TR: 放大器数:双路;; Supplier Part: C87118; Manufacturer: SGMICRO(圣邦微); Supplier Footprint: SOIC-8; JLCPCB Part Class: 扩展库; Datasheet: https://atta.szlcsc.com/upload/public/pdf/source/20180111/C87118_15156545336701259061.pdf; Supplier: LCSC; Number of Circuits: 双路; Supply Voltage: 3V3; Supply Current: 1.76mA; Operating Temperature: -40℃~+125℃

## Nets
3V3: C2.2 C3.2 C4.2 C5.2 C6.2 C13.2 C14.2 C26.1 C27.1 C30.1 C31.1 C32.1 C33.1 C34.1 C35.1 H1.8 H2.1 H3.1 H4.3 H5.1 H5.3 H6.4 H10.5 H11.12(3V3) H12.5 LDO1.5(VOUT) R1.2 R3.2 R45.2 R46.2 R47.2 R48.2 SW2.2 U1.1(VBAT) U1.9(VDDA) U1.24(VDD_1) U1.36(VDD_2) U1.48(VDD_3) U9.16(VDD) U10.16(VDD) U11.8(+VS) U12.8(+VS)
GND: C1.1 C2.1 C3.1 C4.1 C5.1 C6.1 C7.2 C8.1 C9.1 C10.1 C11.1 C12.1 C13.1 C14.1 C15.1 C16.1 C17.1 C18.1 C26.2 C27.2 C30.2 C31.2 C32.2 C33.2 C34.2 C35.2 C36.1 C37.1 CN1.1 H1.7 H2.3 H3.3 H4.1 H4.2 H5.2 H6.1 H10.4 H11.13(GND) H11.21(GND) H11.22(CON) H12.4 H13.1 H13.2 H13.3 H13.4 H13.5 H13.6 H13.7 H13.8 H13.9 H13.10 H13.11 H13.12 H13.13 H13.14 H13.15 H13.16 LDO1.2(VSS) LED1.1(C) LED2.1(C) LED4.1(C) R8.1 R12.2 R14.2 R19.1 R25.1 R28.1 R32.1 R52.2 SW1.1 U1.8(VSSA) U1.23(VSS_1) U1.35(VSS_2) U1.47(VSS_3) U2.1(TEMP) U2.3(GND) U7.3(ANODE) U8.3(ANODE) U9.6(INH) U9.7(VEE) U9.8(VSS) U10.6(INH) U10.7(VEE) U10.8(VSS) U11.4(-VS) U12.4(-VS) USB1.7(EH) USB1.A12(GND) USB1.B12(GND) X2.2(GND) X2.4(GND)
VIN: C11.2 C12.2 H8.2 LDO1.1(VIN) LDO1.3(CE)
ADC1: H4.12 R30.2 U1.14(PA4) U12.7(OUTB)
ADC2: H4.11 R26.2 U1.15(PA5) U12.1(OUTA)
ADC3: H4.8 R23.2 U1.18(PB0) U11.7(OUTB)
ADC4: H4.7 R15.2 U1.19(PB1) U11.1(OUTA)
AT: H5.13 H10.6 R51.2 SW2.1 U1.32(PA11)
BAT: C17.2 C18.2 CN1.2 H8.3 U2.5(BAT)
BLE_RX: H5.15 H10.2 H11.2(RX) U1.30(PA9)
BLE_RX_2: H4.6 U1.21(PB10)
BLE_STATE: H5.16 H10.1 R50.2 U1.29(PA8)
BLE_TX: H5.14 H10.3 H11.1(TX) U1.31(PA10)
BLE_TX_2: H4.5 U1.22(PB11)
BOOT0: R4.2 U1.44(BOOT0)
BOOT1: R5.1 U1.20(PB2)
IMU_INT: H1.1 H5.5 U1.45(PB8)
NRST: C1.2 H4.4 R3.1 SW1.2 U1.7(NRST)
OSC32_IN: C8.2 H4.18 U1.3(PC14-OSC32_IN) X1.1
OSC32_OUT: C9.2 H4.17 U1.4(PC15-OSC32_OUT) X1.2
OSC_IN: C7.1 U1.5(PD0-OSC_IN) X2.1
OSC_OUT: C10.2 U1.6(PD1-OSC_OUT) X2.3
PA0: H4.16 U1.10(PA0-WKUP)
PA1: H4.15 U1.11(PA1)
PA2: H4.14 U1.12(PA2)
PA3: H4.13 U1.13(PA3)
PA6: H4.10 U1.16(PA6) U9.10(A) U10.10(A)
PA7: H4.9 U1.17(PA7) U9.9(B) U10.9(B)
PA12: H5.12 U1.33(PA12)
PA13/SWDIO: H6.3 U1.34(PA13)
PA14/SWCLK: H6.2 U1.37(PA14)
PA15: H5.11 U1.38(PA15)
PB3: H5.10 U1.39(PB3)
PB4: H5.9 U1.40(PB4)
PB5: H5.8 U1.41(PB5)
PB6: H1.6 H5.7 R47.1 U1.42(PB6)
PB7: H1.5 H5.6 R48.1 U1.43(PB7)
PB9: H5.4 U1.46(PB9)
PB12: H5.20 U1.25(PB12)
PB13: H5.19 U1.26(PB13)
PB14: H5.18 U1.27(PB14)
PB15: H5.17 U1.28(PB15)
PC13: H4.19 R2.2 U1.2(PC13-TAMPER-RTC)
R_CHANNEL_1: R53.1 U10.3(Y_COMOUT/IN)
R_CHANNEL_2: R54.1 U10.13(X_COMIN/OUT)
R_CHANNEL_3: R55.1 U9.3(Y_COMOUT/IN)
R_CHANNEL_4: R56.1 U9.13(X_COMIN/OUT)
RIN_1: H14.1 U10.1(Y_CH_0_IN/OUT)
RIN_2: H14.2 U10.5(Y_CH_1_IN/OUT)
RIN_3: H14.3 U10.2(Y_CH_2_IN/OUT)
RIN_4: H14.4 U10.4(Y_CH_3_IN/OUT)
RIN_5: H14.5 U10.12(X_CH_0_IN/OUT)
RIN_6: H14.6 U10.14(X_CH_1_IN/OUT)
RIN_7: H14.7 U10.15(X_CH_2_IN/OUT)
RIN_8: H14.8 U10.11(X_CH_3_IN/OUT)
RIN_9: H14.9 U9.1(Y_CH_0_IN/OUT)
RIN_10: H14.10 U9.5(Y_CH_1_IN/OUT)
RIN_11: H14.11 U9.2(Y_CH_2_IN/OUT)
RIN_12: H14.12 U9.4(Y_CH_3_IN/OUT)
RIN_13: H14.13 U9.12(X_CH_0_IN/OUT)
RIN_14: H14.14 U9.14(X_CH_1_IN/OUT)
RIN_15: H14.15 U9.15(X_CH_2_IN/OUT)
RIN_16: H14.16 U9.11(X_CH_3_IN/OUT)
VREF_1: C36.2 R27.1 R31.1 R45.1 U8.1(CATHODE) U8.2(REF)
VREF_2: C37.2 R16.1 R24.1 R46.1 U7.1(CATHODE) U7.2(REF)
VUSB: C15.2 C16.2 H8.1 R6.1 R9.1 U2.4(VCC) U2.8(CE) USB1.A9(VBUS) USB1.B9(VBUS)
$1N2074: LED1.2(A) R1.1
$1N2077: LED2.2(A) R2.1
$1N3296: H3.2 R5.2
$1N11047: H2.2 R4.1
$2N370: R8.2 U2.2(PROG)
$2N655: U2.6(STDBY) U3.1(K)
$2N660: R9.2 U3.2(A)
$2N665: LED3.2(-) U2.7(CHRG)
$2N669: LED3.1(+) R6.2
$2N1135: R12.1 USB1.A5(CC1)
$2N1136: R14.1 USB1.B5(CC2)
$3N3484: R31.2 R32.2 U12.5(INB+)
$3N3577: R27.2 R28.2 U12.3(INA+)
$3N3823: R24.2 R25.2 U11.5(INB+)
$3N3894: R16.2 R19.2 U11.3(INA+)
$3N14374: R30.1 R53.2 U12.6(INB-)
$3N14434: R26.1 R54.2 U12.2(INA-)
$3N14466: R23.1 R55.2 U11.6(INB-)
$3N14499: R15.1 R56.2 U11.2(INA-)
$6N516: LED4.2(A) R49.2
$6N537: H11.31(PIO8) R49.1
$6N542: H11.32(PIO9) R50.1
$6N596: H11.34(PIO11) R51.1 R52.1

Not connected (* = marked no-connect by the designer): H1 2* 3* 4*; H4 20; H11 3(CTS)* 4(RTS)* 5(PCM-CLK)* 6(PCM-OUT)* 7(PCM-IN)* 8(PCM-SYNC)* 9(AIO0)* 10(AIO1)* 11(RST)* 14(NC)* 15(USB D-)* 16(CSB)* 17(MOSI)* 18(MISO)* 19(CLK)* 20(USB D+)* 23(PIO0)* 24(PIO1)* 25(PIO2)* 26(PIO3)* 27(PIO4)* 28(PIO5)* 29(PIO6)* 30(PIO7)* 33(PIO10)*; H12 1 2 3 6; LDO1 4(NC)*; U2 9(EP)*

## Notes on the sheets
sheet 1
- 上拉电阻模块有，可不连接
- IMU
- BLE
- LED指示电路
- 复位电路
- BOOT模式选择
- 主控电源滤波
- SWD下载接口
- STM32F103C8T6
- 拓展排针接口
- 晶振电路
sheet 2
- 3.3V
- 选择电池供电/USB供电
- Type-C供电
